# EasyEDA schematic extraBoardv3.json
TITLE: Sheet_1; REV: 1.0; Date: 2023-10-21; Sheet: 1/1; Drawn By: breckcmassey; Company: Your Company
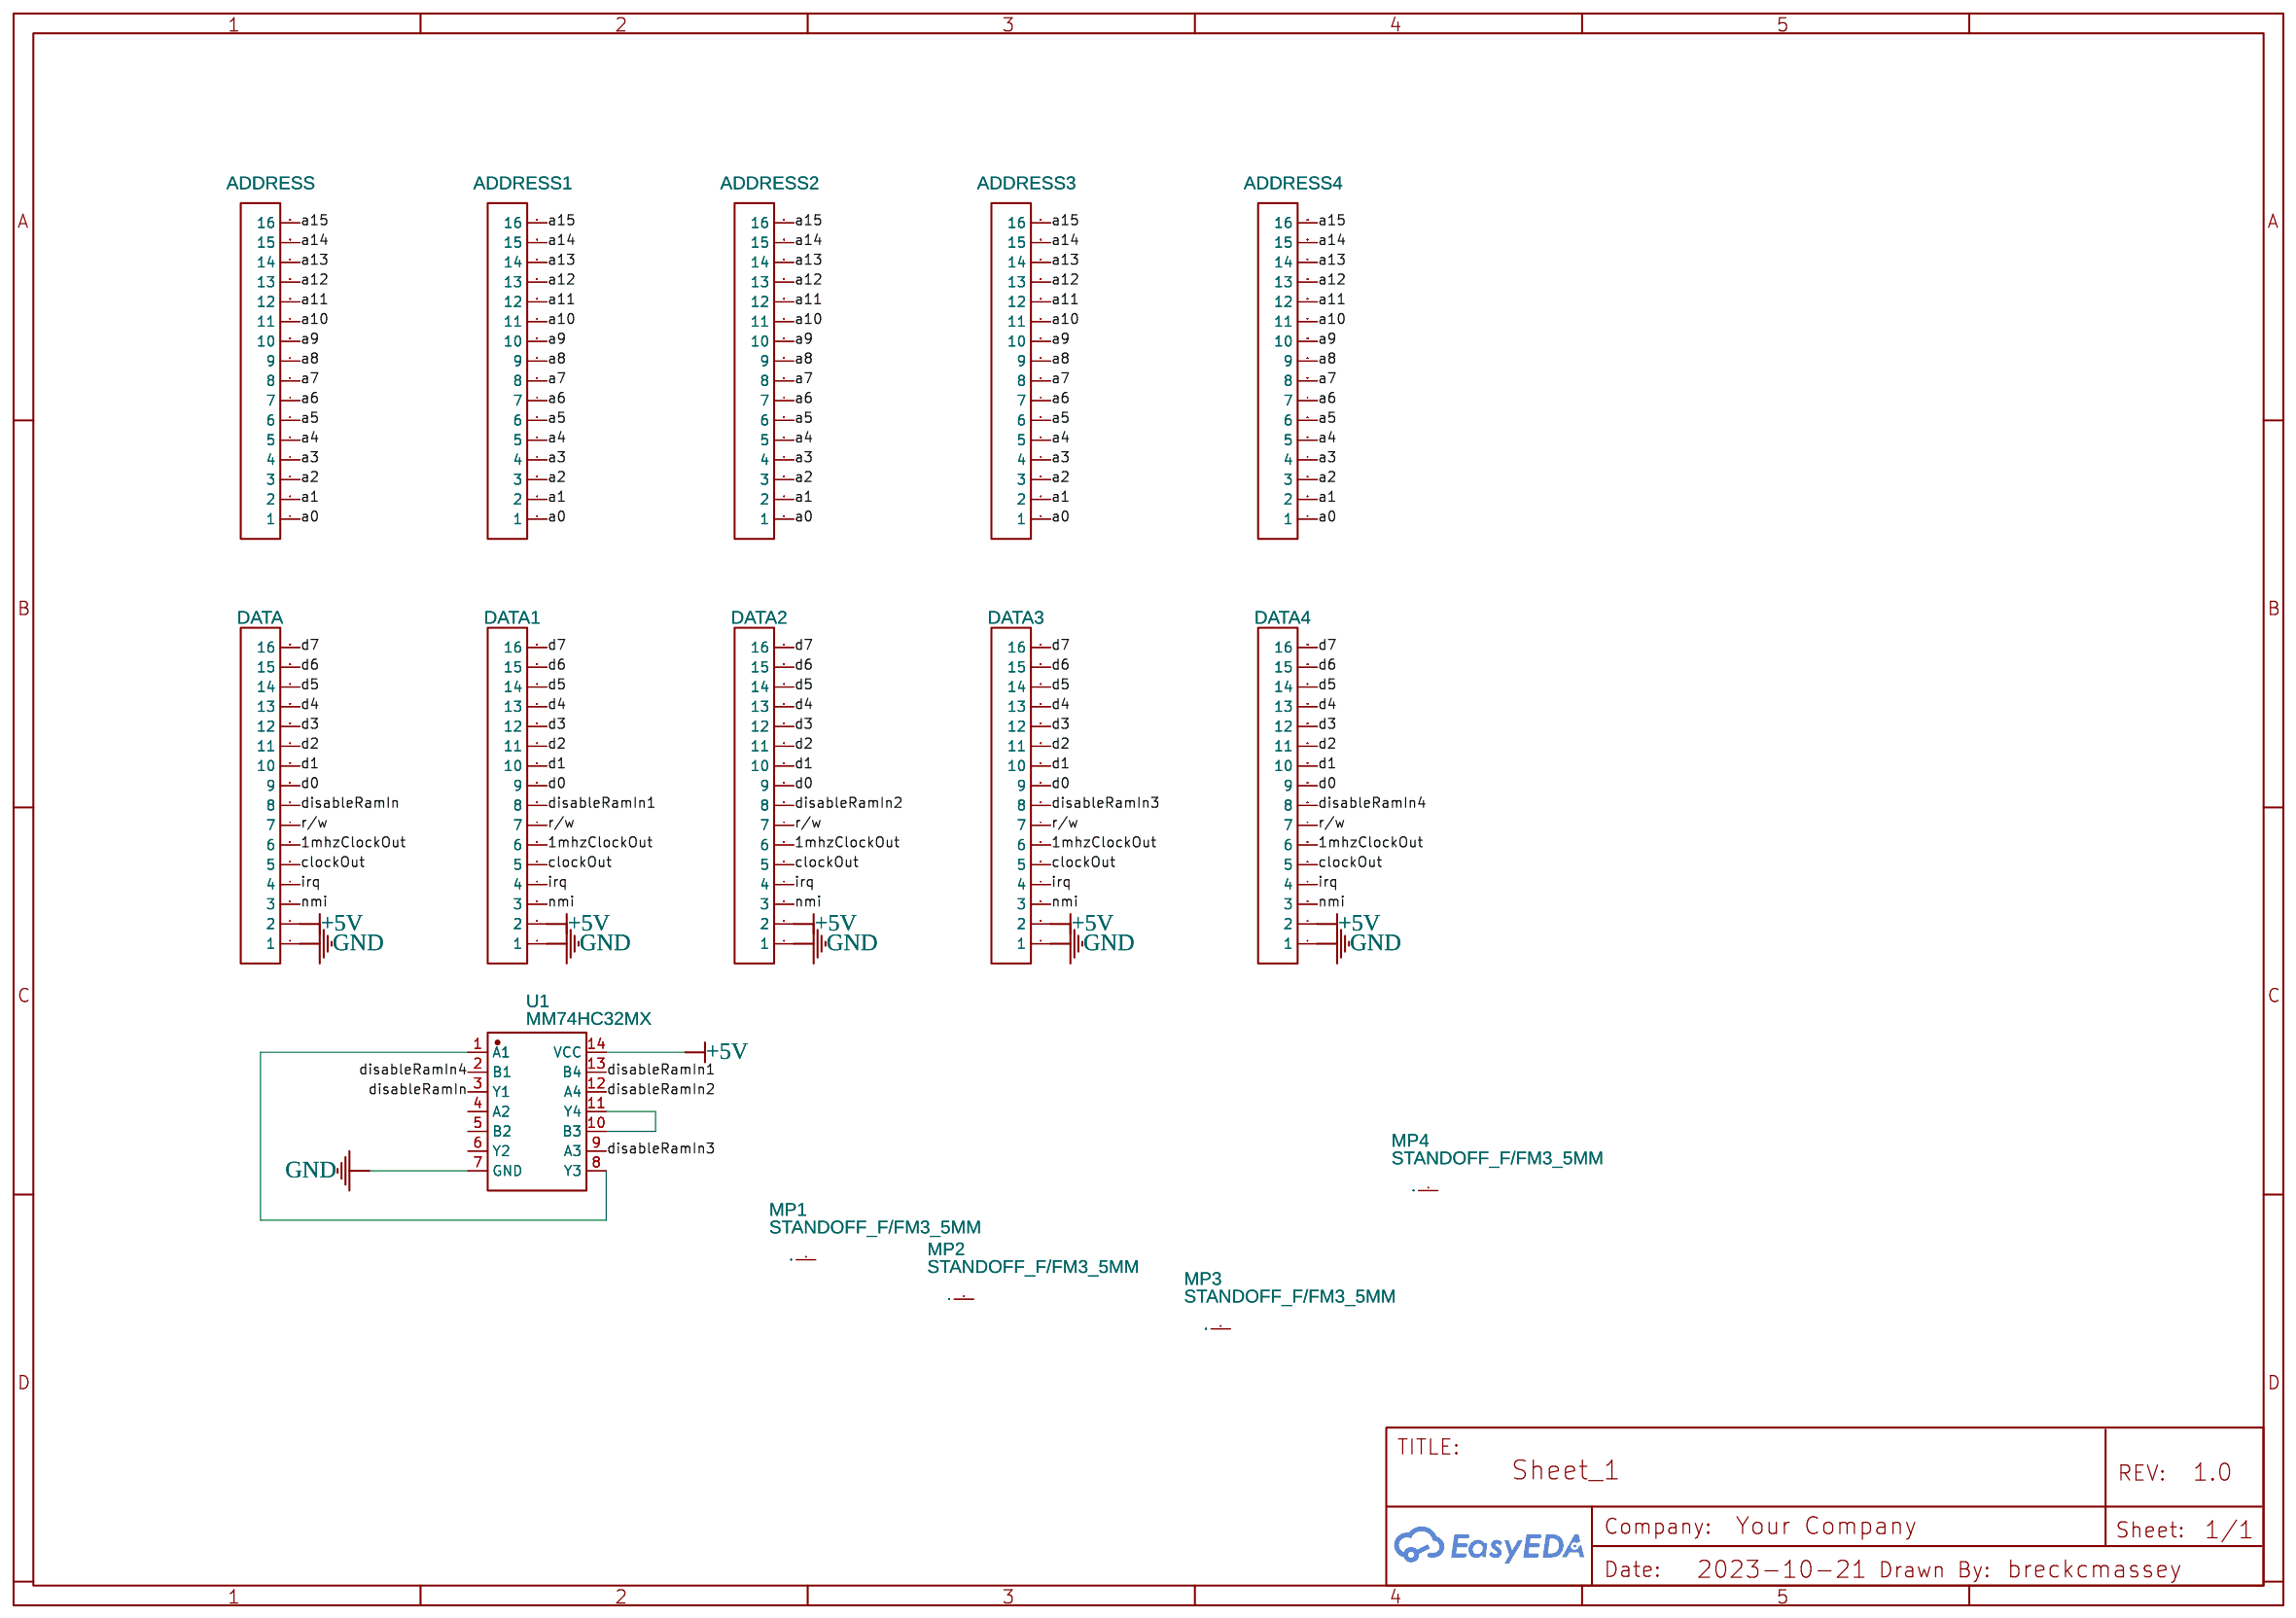
[diagram p0: schematic sheet]

## Parts
ADDRESS  HDR-M-2.54_1x16  [HDR-M-2.54_1X16]
ADDRESS1  HDR-M-2.54_1x16  [HDR-M-2.54_1X16]
ADDRESS2  HDR-M-2.54_1x16  [HDR-M-2.54_1X16]
ADDRESS3  HDR-M-2.54_1x16  [HDR-M-2.54_1X16]
ADDRESS4  HDR-M-2.54_1x16  [HDR-M-2.54_1X16]
DATA  HDR-M-2.54_1x16  [HDR-M-2.54_1X16]
DATA1  HDR-M-2.54_1x16  [HDR-M-2.54_1X16]
DATA2  HDR-M-2.54_1x16  [HDR-M-2.54_1X16]
DATA3  HDR-M-2.54_1x16  [HDR-M-2.54_1X16]
DATA4  HDR-M-2.54_1x16  [HDR-M-2.54_1X16]
MP1  STANDOFF_F/FM3_5MM  [STANDOFF_HEX_FEMALE_550X500_M3X0.5_MTGP850H320]
MP2  STANDOFF_F/FM3_5MM  [STANDOFF_HEX_FEMALE_550X500_M3X0.5_MTGP850H320]
MP3  STANDOFF_F/FM3_5MM  [STANDOFF_HEX_FEMALE_550X500_M3X0.5_MTGP850H320]
MP4  STANDOFF_F/FM3_5MM  [STANDOFF_HEX_FEMALE_550X500_M3X0.5_MTGP850H320]
U1  MM74HC32MX  [SOIC-14_L8.7-W3.9-P1.27-LS6.0-BL]

## Library data of the parts
ADDRESS ADDRESS1-ADDRESS4 DATA DATA1-DATA4 = HDR-M-2.54_1x16: Supplier: LCSC; Contributor: LCEDA_Lib
MP1-MP4 = STANDOFF_F/FM3_5MM
U1 = MM74HC32MX: Contributor: LCSC; Supplier: LCSC; Supplier Part: C904255; Manufacturer: onsemi(安森美); JLCPCB Part Class: Extended Part; link: https://lcsc.com/eda_search?q=C904255&%26type=1&ref=editor

## Nets
+5V: DATA.2 DATA1.2 DATA2.2 DATA3.2 DATA4.2 U1.14(VCC)
GND: DATA.1 DATA1.1 DATA2.1 DATA3.1 DATA4.1 U1.7(GND)
1mhzClockOut: DATA.6 DATA1.6 DATA2.6 DATA3.6 DATA4.6
a0: ADDRESS.1 ADDRESS1.1 ADDRESS2.1 ADDRESS3.1 ADDRESS4.1
a1: ADDRESS.2 ADDRESS1.2 ADDRESS2.2 ADDRESS3.2 ADDRESS4.2
a2: ADDRESS.3 ADDRESS1.3 ADDRESS2.3 ADDRESS3.3 ADDRESS4.3
a3: ADDRESS.4 ADDRESS1.4 ADDRESS2.4 ADDRESS3.4 ADDRESS4.4
a4: ADDRESS.5 ADDRESS1.5 ADDRESS2.5 ADDRESS3.5 ADDRESS4.5
a5: ADDRESS.6 ADDRESS1.6 ADDRESS2.6 ADDRESS3.6 ADDRESS4.6
a6: ADDRESS.7 ADDRESS1.7 ADDRESS2.7 ADDRESS3.7 ADDRESS4.7
a7: ADDRESS.8 ADDRESS1.8 ADDRESS2.8 ADDRESS3.8 ADDRESS4.8
a8: ADDRESS.9 ADDRESS1.9 ADDRESS2.9 ADDRESS3.9 ADDRESS4.9
a9: ADDRESS.10 ADDRESS1.10 ADDRESS2.10 ADDRESS3.10 ADDRESS4.10
a10: ADDRESS.11 ADDRESS1.11 ADDRESS2.11 ADDRESS3.11 ADDRESS4.11
a11: ADDRESS.12 ADDRESS1.12 ADDRESS2.12 ADDRESS3.12 ADDRESS4.12
a12: ADDRESS.13 ADDRESS1.13 ADDRESS2.13 ADDRESS3.13 ADDRESS4.13
a13: ADDRESS.14 ADDRESS1.14 ADDRESS2.14 ADDRESS3.14 ADDRESS4.14
a14: ADDRESS.15 ADDRESS1.15 ADDRESS2.15 ADDRESS3.15 ADDRESS4.15
a15: ADDRESS.16 ADDRESS1.16 ADDRESS2.16 ADDRESS3.16 ADDRESS4.16
clockOut: DATA.5 DATA1.5 DATA2.5 DATA3.5 DATA4.5
d0: DATA.9 DATA1.9 DATA2.9 DATA3.9 DATA4.9
d1: DATA.10 DATA1.10 DATA2.10 DATA3.10 DATA4.10
d2: DATA.11 DATA1.11 DATA2.11 DATA3.11 DATA4.11
d3: DATA.12 DATA1.12 DATA2.12 DATA3.12 DATA4.12
d4: DATA.13 DATA1.13 DATA2.13 DATA3.13 DATA4.13
d5: DATA.14 DATA1.14 DATA2.14 DATA3.14 DATA4.14
d6: DATA.15 DATA1.15 DATA2.15 DATA3.15 DATA4.15
d7: DATA.16 DATA1.16 DATA2.16 DATA3.16 DATA4.16
disableRamIn: DATA.8 U1.3(Y1)
disableRamIn1: DATA1.8 U1.13(B4)
disableRamIn2: DATA2.8 U1.12(A4)
disableRamIn3: DATA3.8 U1.9(A3)
disableRamIn4: DATA4.8 U1.2(B1)
irq: DATA.4 DATA1.4 DATA2.4 DATA3.4 DATA4.4
nmi: DATA.3 DATA1.3 DATA2.3 DATA3.3 DATA4.3
r/w: DATA.7 DATA1.7 DATA2.7 DATA3.7 DATA4.7
Net-(U1-1): U1.1(A1) U1.8(Y3)
Net-(U1-10): U1.10(B3) U1.11(Y4)

Not connected (* = marked no-connect by the designer): MP1 1(P$1); MP2 1(P$1); MP3 1(P$1); MP4 1(P$1); U1 4(A2) 5(B2) 6(Y2)
